# Altium project RX_test_01.PrjPcb (part 4 of 5)

## Sheet LO 2.SchDoc
size A4; SheetNumber: 9; SheetTotal: 12
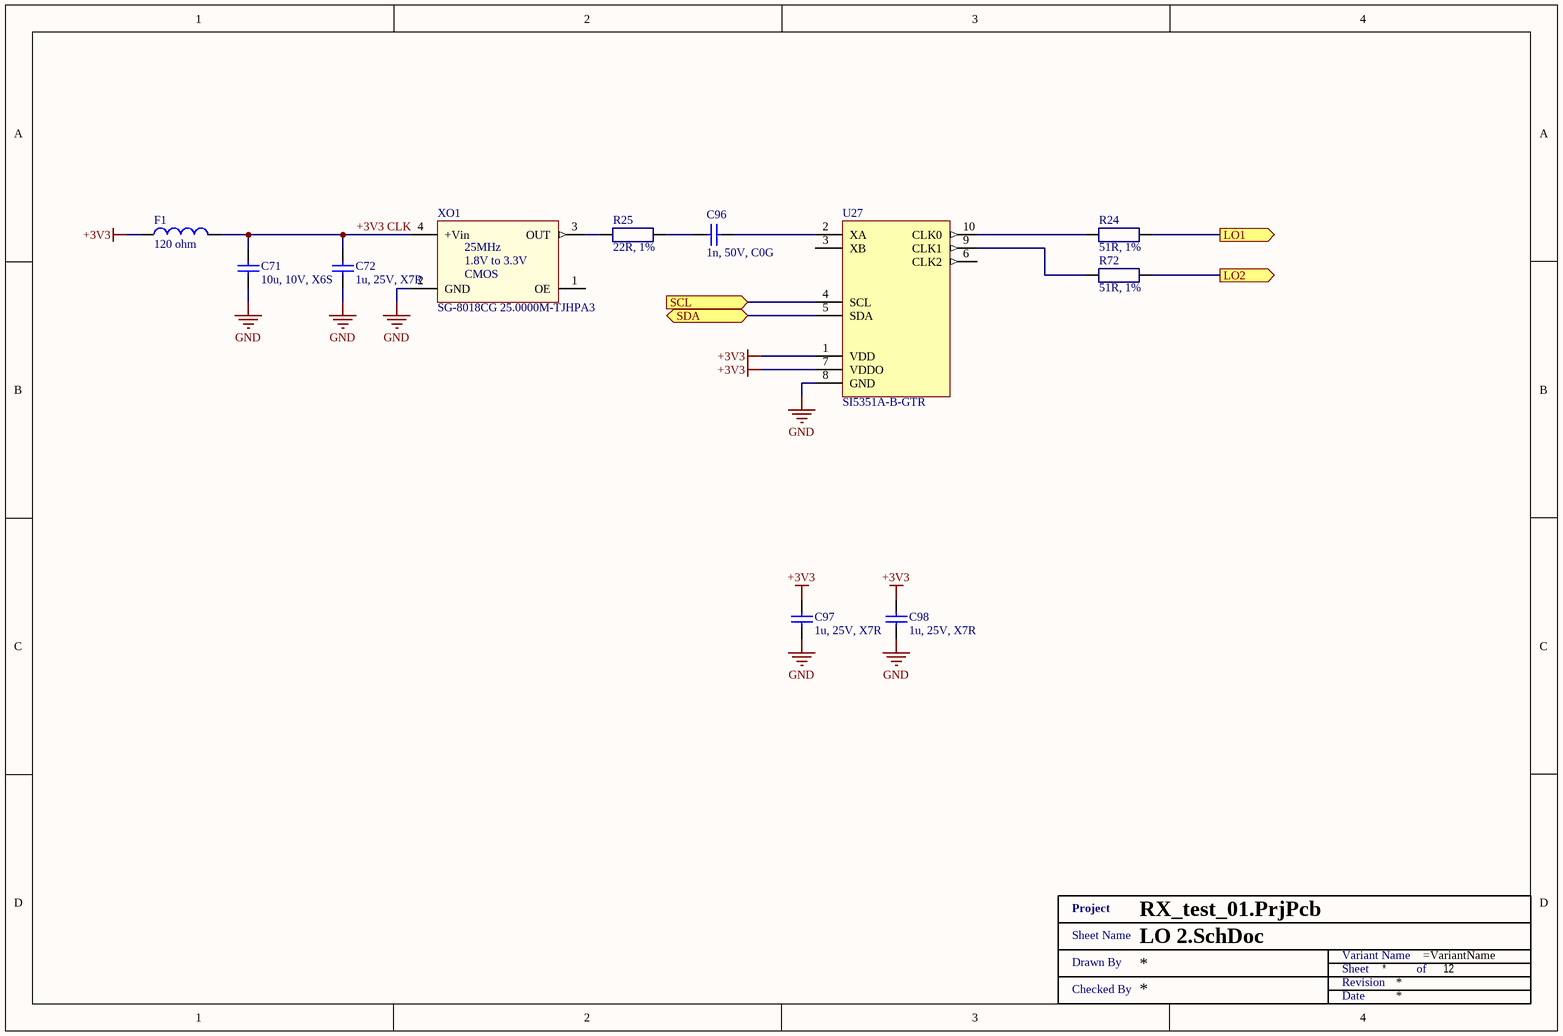
[diagram p8: LO 2.SchDoc]

### Parts
(Parts that share a designator on the sheet are numbered #1, #2 ... from top to bottom, then left to right.)
C71  10u, 10V, X6S  [SMD0603]
C72  1u, 25V, X7R  [SMD0603]
C96  1n, 50V, C0G  [SMD0603]
C97  1u, 25V, X7R  [SMD0603]
C98  1u, 25V, X7R  [SMD0603]
F1  120 ohm  [SMD0805 - R]
R24  51R, 1%  [SMD0603 - R]
R25  22R, 1%  [SMD0603 - R]
R72  51R, 1%  [SMD0603 - R]
U27  SI5351A-B-GTR  [MSOP-10]
XO1  SG-8018CG 25.0000M-TJHPA3  [XO 2.5x2.0mm]
XX?#9  Title 1  (value not drawn)  (graphical)

### Ports
LO1 (out), LO2 (out), SCL (in), SDA (bidir)

### Nets
+3V3: C97.2 C98.2 F1.2 U27.1(VDD) U27.7(VDDO)
GND: C71.1 C72.1 C97.1 C98.1 U27.8(GND) XO1.2(GND)
+3V3 CLK: C71.2 C72.2 F1.1 XO1.4(+Vin)
SCL: U27.4(SCL) ; port SCL
SDA: U27.5(SDA) ; port SDA
NetC73_1: R72.2 ; port LO2
NetC96_1: C96.1 R25.2
NetC96_2: C96.2 U27.2(XA)
NetR24_1: R24.1 U27.10(CLK0)
NetR24_2: R24.2 ; port LO1
NetR25_1: R25.1 XO1.3(OUT)
NetR72_1: R72.1 U27.9(CLK1)

Not connected (* = marked no-connect by the designer): U27 3(XB) 6(CLK2); XO1 1(OE)

### Notes on the sheet
- (in symbol SG-8018CG 25.0000M-TJHPA3) 1.8V to 3.3V; CMOS
- (in symbol Title 1) Project; Sheet Name; Variant Name; Drawn By; Sheet; of; Revision; Checked By; Date

### Library data of the parts
C71 = GRT188C81A106ME13D: Cap Ceramic 10uF 10V X6S 20% Pad SMD 0603 105C Automotive T/R; Manufacturer: Murata; Supplier 1: Mouser; Supplier Part Number 1: 81-GRT188C81A106ME3D; Manufacturer Part Number: GRT188C81A106ME13D; RoHS: No; Category: Ceramic Capacitors; Stock 1: 1862; Pricing 1: 1=0.41000, 10=0.20100, 50=0.20100, 100=0.17200, 1000=0.10900, 10000=0.09700 (USD); Mount: Surface Mount; Case/Package: 0603; Case Code (Metric): 1608; Case Code (Imperial): 0603; Min Operating Temperature: -55°C; Max Operating Temperature: 105°C; Packaging: Tape and Reel; Capacitance: 10uF; Voltage Rating: 10V; Tolerance: 20%; Length: 0.063inch; Width: 0.031inch; Thickness: 0.035inch; Ratings: AEC-Q200; ComponentLink1URL: http://search.murata.co.jp/Ceramy/image/img/A01X/G101/ENG/GRT188C81A106ME13-01.pdf?src-supplier=Digi-Key; ComponentLink1Description: http://search.murata.co.jp/Ceramy/image/img/A01X/G101/ENG/GRT188C81A106ME13-01.pdf?src-supplier=Digi-Key; Supplier 2: Farnell; Supplier Part Number 2: 3582904; Supplier 3: Digi-Key; Supplier Part Number 3: 490-12283-6-ND
C72 C97 C98 = CGA3E1X7R1E105K080AC: CAP CER 1UF 25V X7R 0603; Manufacturer: TDK Corporation; Tolerance: ±10%; Manufacturer Part Number: CGA3E1X7R1E105K080AC; RoHS: RoHS Compliant; Category: Capacitors; Stock 1: 109509; Pricing 1: 1=0.2, 10=0.135, 100=0.0686, 500=0.04696, 1000=0.04154 (USD); Packaging: Cut Tape (CT); Part Status: Active; Voltage - Rated: 25V; Temperature Coefficient: X7R; Operating Temperature: -55°C ~ 125°C; Features: -; Ratings: AEC-Q200; Applications: Automotive; Failure Rate: -; Mounting Type: Surface Mount, MLCC; Package / Case: 0603 (1608 Metric); Size / Dimension: 0.063" L x 0.032" W (1.60mm x 0.80mm); Height - Seated (Max): -; Thickness (Max): 0.035" (0.90mm); Lead Spacing: -; Lead Style: -; ComponentLink1URL: https://product.tdk.com/info/en/catalog/datasheets/mlcc_automotive_general_en.pdf; ComponentLink1Description: https://product.tdk.com/info/en/catalog/datasheets/mlcc_automotive_general_en.pdf; Capacitance: 1u; Supplier Part Number 2: 2346962
  C72: Supplier 1: Mouser; Supplier Part Number 1: 810-CGA3E1X7R1E105K; Supplier 2: Farnell; Supplier 3: Digi-Key; Supplier Part Number 3: 445-6931-1-ND
  C97 C98: Supplier 1: Digi-Key; Supplier Part Number 1: 445-6931-1-ND; Supplier 2: Mouser; Supplier Part Number 3: 810-CGA3E1X7R1E105K
C96 = MCU0603C102JCT: MULTICOMP - MCU0603C102JCT - CAP, MLCC, C0G/NP0, 1NF, 50V, 0603; Ceramic Capacitor Case: 0603 [1608 Metric]; Voltage Rating: 50; Capacitance Tolerance: ± 5%; Product Range: MCU Series; SVHC: No SVHC (07-Jul-2017); Capacitance Tolerance +: 5%; Capacitor Terminals: SMD; External Depth: 0.8; External Length / Height: 1.6; No. of Pins: 2; Reel Quantity: 4000; Temperature Coefficient: 0ppm/°C ± 30; Voltage Rating V DC: 50V<!--FANDB--><div class="features-and-benefits-container"><div class="features-and-benefits-desc-container"><span class="features-and-benefits-container-desc">SMD Multilayer Ceramic Capacitor, 0603 [1608 Metric], 1000 pF, 50 V, ± 5%, C0G / NP0; Supplier 1: Farnell; Supplier Part Number 1: 9406131; Manufacturer: MULTICOMP; Manufacturer Part Number: MCU0603C102JCT; RoHS: YES; Stock 1: 25831; Pricing 1: 10=0.0164, 100=0.0133, 500=0.0095, 1000=0.0082, 2000=0.0065 (GBP); Capacitance: 1n; Dielectric Characteristic: C0G / NP0; Packaging: Cut Tape; Operating Temperature Min: -55; Operating Temperature Max: 125; Automotive Qualification Standard: -; MSL: -; Capacitance Tolerance ±: ± 5%; External Width: 0.8; Operating Temperature Range: -55°C to +125; Tape Width: 8; Tolerance +: 5%; Tolerance -: 5%; ComponentLink1URL: http://www.farnell.com/datasheets/1723231.pdf; ComponentLink1Description: http://www.farnell.com/datasheets/1723231.pdf
F1 = 742792023: WURTH ELEKTRONIK - 742792023 - FERRITE BEAD, 0.03OHM, 3A, 0805; Impedance @ 100MHz: 120; Ferrite Case Style: 0805 [2012 Metric]; DC Current Rating: 3; DC Resistance Max: 0.03; Impedance Tolerance: ± 25%; Ferrite Mounting: SMD; Resistance: 0.03ohm<!--FANDB--><div class="features-and-benefits-container"><div class="features-and-benefits-description"><span class="features-benefits-value">The 742792023 is a SMD EMI Suppression Ferrite Bead with 0805 case and reliable Ni-Sn electrodes. It can be put directly on the printed circuit board. It offers excellent anti-EMI properties and low DC resistance. Placed very close next to the interference source even with smallest size 0402, maximal impedance at 1000; Manufacturer: WURTH ELEKTRONIK; Manufacturer Part Number: 742792023; RoHS: YES; Stock 1: 4283; Pricing 1: 1=0,123, 50=0,112, 100=0,103, 500=0,0937, 1000=0,0877, 2000=0,0846 (GBP); Product Range: -; Automotive Qualification Standard: -; Packaging: Cut Tape; ComponentLink1URL: http://www.farnell.com/datasheets/1695980.pdf; ComponentLink1Description: http://www.farnell.com/datasheets/1695980.pdf; ComponentLink2URL: http://www.farnell.com/cad/1670054.zip; ComponentLink2Description: http://www.farnell.com/cad/1670054.zip; Supplier 1: Mouser; Supplier Part Number 1: 710-742792023; Supplier 2: Farnell; Supplier Part Number 2: 1635732; Supplier 3: Digi-Key; Supplier Part Number 3: 732-1613-1-ND
R24 R72 = CRCW060351R0FKEA: RES SMD 51 OHM 1% 1/10W 0603; Manufacturer: Vishay Dale; Power (Watts): 0.1W, 1/10W; Temperature Coefficient: ±100ppm/°C; Manufacturer Part Number: CRCW060351R0FKEA; RoHS: RoHS Compliant; Category: Resistors; Stock 1: 21691; Pricing 1: 1=0.1, 10=0.042, 100=0.017, 1000=0.00764, 2500=0.00663 (USD); Packaging: Cut Tape (CT); Part Status: Active; Tolerance: ±1%; Composition: Thick Film; Features: Automotive AEC-Q200; Operating Temperature: -55°C ~ 155°C; Package / Case: 0603 (1608 Metric); Supplier Device Package: 0603; Size / Dimension: 0.063" L x 0.033" W (1.60mm x 0.85mm); Height - Seated (Max): 0.020" (0.50mm); Failure Rate: -; ComponentLink1URL: http://www.vishay.com/docs/20035/dcrcwe3.pdf; ComponentLink1Description: http://www.vishay.com/docs/20035/dcrcwe3.pdf; Resistance: 51R; Supplier 1: Mouser; Supplier Part Number 1: 71-CRCW0603-51-E3; Supplier 2: Farnell; Supplier Part Number 2: 1652889; Supplier 3: Digi-Key; Supplier Part Number 3: 541-51.0HCT-ND
R25 = RC0603FR-0722RL: YAGEO (PHYCOMP) - RC0603FR-0722RL - RES, THICK FILM, 22R, 1%, 0.1W, 0603; Voltage Rating: 50; Resistor Case Style: 0603 [1608 Metric]; Power Rating: 100; Product Range: RC Series; Temperature Coefficient: ± 100; SVHC: No SVHC (20-Jun-2016); External Depth: 0.45; External Length / Height: 1.6; External Width: 0.8; Full Power Rating Temperature: 70; No. of Pins: 2; Reel Quantity: 5000; Resistor Mounting: Surface Mount Device; Voltage Rating V DC: 50V<!--FANDB--><div class="features-and-benefits-container"><div class="features-and-benefits-desc-container"><span class="features-and-benefits-container-desc">SMD Chip Resistor, Thick Film, 22 ohm, 50 V, 0603 [1608 Metric], 100 mW, ± 1%, RC Series</span></div><div class="features-and-benefits-description"><span class="features-benefits-value">The Yageo RC_L series resistors are general purpose thick film chip resistors with lead free terminations made by thick film process. The resistance range includes E24 and E96 decade values from 1ohm to 100Mohm. These resistors are constructed on top of a high grade ceramic body.</span></div><div class="features-and-benefits-list"><ul class="features-and-benefits-list-list"><li class="features-and-benefits-list-item">EIA 0075, 0100, 0201, 0402, 0603, 0805, 1206, 1210, 1218, 2010, 2512 case sizes available</li><li class="features-and-benefits-list-item">Small chip sizes save PCB space</li><li class="features-and-benefits-list-item">Rated voltage range of 10V to 200V</li><li class="features-and-benefits-list-item">Maximum power rating of 2W</li><li class="features-and-benefits-list-item">Available in ±0.1%, ±0.5%, ±1% and ±5% tolerance</li><li class="features-and-benefits-list-item">High component and equipment reliability</li><li class="features-and-benefits-list-item">Forbidden materials are not used in products/production</li><li class="features-and-benefits-list-item">-55°C to 155°C temperature range for RC0402 to RC2512 and -55°C to 125°C for RC0075 to RC0201; Manufacturer: YAGEO (PHYCOMP); Manufacturer Part Number: RC0603FR-0722RL; RoHS: YES; Stock 1: 33025; Pricing 1: 10=0.0102, 100=0.0068, 500=0.0051, 1000=0.0041, 2500=0.0034 (GBP); Resistance: 22R; Resistance Tolerance: ± 1%; Packaging: Cut Tape; Resistor Element Material: Thick Film; Automotive Qualification Standard: -; MSL: MSL 1 - Unlimited; Operating Temperature Max: 155; Operating Temperature Min: -55; Operating Temperature Range: -55°C to +155; Temperature Coeff. +: 100; Temperature Coeff. -: 100; Tolerance +: 1%; Tolerance -: 1%; ComponentLink1URL: http://www.farnell.com/datasheets/2167052.pdf; ComponentLink1Description: http://www.farnell.com/datasheets/2167052.pdf; ComponentLink2URL: http://www.farnell.com/cad/1555248.zip; ComponentLink2Description: http://www.farnell.com/cad/1555248.zip; Supplier 1: Mouser; Supplier Part Number 1: 603-RC0603FR-0722RL; Supplier 2: Farnell; Supplier Part Number 2: 9238280; Supplier 3: Digi-Key; Supplier Part Number 3: 311-22.0HRCT-ND
U27 = SI5351A-B-GTR: IC CLK GENERATOR 200MHZ 10MSOP; Manufacturer: Silicon Labs; Number of Outputs: 3; Max Duty Cycle: 55%; Operating Supply Current: 22mA; Number of Circuits: 2; Input: Crystal; PLL: Yes; Operating Supply Voltage: 3.3V; Supplier 1: Mouser; Supplier Part Number 1: 634-SI5351A-B-GTR; Manufacturer Part Number: SI5351A-B-GTR; RoHS: Yes; Category: Clock Generators, PLLs, Frequency Synthesizers; Mount: Surface Mount; Case/Package: MSOP; Number of Pins: 10; Min Operating Temperature: -40°C; Max Operating Temperature: 85°C; Packaging: Tape and Reel; Package Quantity: 2500; Max Frequency: 200MHz; Series: MultiSynth™; RoHS Compliant: Yes; ComponentLink1URL: http://www.mouser.com/ds/2/368/Si5351-B-346869.pdf?src-supplier=Mouser; ComponentLink1Description: http://www.mouser.com/ds/2/368/Si5351-B-346869.pdf?src-supplier=Mouser; ComponentLink2URL: https://www.silabs.com/Support%20Documents/TechnicalDocs/Si5350-51-short.pdf?src-supplier=Digi-Key; ComponentLink2Description: https://www.silabs.com/Support%20Documents/TechnicalDocs/Si5350-51-short.pdf?src-supplier=Digi-Key; ComponentLink3URL: https://www.silabs.com/documents/public/data-sheets/Si5351-B.pdf?src-supplier=Digi-Key; ComponentLink3Description: https://www.silabs.com/documents/public/data-sheets/Si5351-B.pdf?src-supplier=Digi-Key; ComponentLink4URL: https://www.silabs.com/Support%20Documents/TechnicalDocs/Si5351-B.pdf?src-supplier=Avnet; ComponentLink4Description: https://www.silabs.com/Support%20Documents/TechnicalDocs/Si5351-B.pdf?src-supplier=Avnet; ComponentLink5URL: https://www.silabs.com/Support%20Documents/TechnicalDocs/Si5351-B.pdf?src-supplier=Avnet+Asia; ComponentLink5Description: https://www.silabs.com/Support%20Documents/TechnicalDocs/Si5351-B.pdf?src-supplier=Avnet+Asia; Supplier 2: Farnell; Supplier Part Number 2: 3105964; Supplier 3: Digi-Key; Supplier Part Number 3: 336-3908-1-ND
XO1 = SG-8018CG 25.0000M-TJHPA3: Oscillator XO 25MHz ±50ppm 15pF CMOS 55% 1.8V/2.5V/3.3V 4-Pin SMD T/R; Manufacturer: Epson; Supplier 1: Mouser; Supplier Part Number 1: 732-CG25M-TJHPA3; Manufacturer Part Number: SG-8018CG 25.0000M-TJHPA3; Stock 1: 221; Pricing 1: 1=1,11000, 10=1,03000, 100=0,88700, 250=0,88700, 500=0,78900, 1000=0,72700 (USD); ComponentLink1URL: http://datasheet.octopart.com/SG-8018CG-25.0000M-TJHPA3-Epson-datasheet-137868109.pdf?src-supplier=Future+Electronics; ComponentLink1Description: http://datasheet.octopart.com/SG-8018CG-25.0000M-TJHPA3-Epson-datasheet-137868109.pdf?src-supplier=Future+Electronics; Supplier 2: Arrow; Supplier Part Number 2: SG-8018CG 25.0000M-TJHPA3; Supplier 3: Future Electronics; Supplier Part Number 3: SG-8018CG 25.0000M-TJHPA3-REEL; Freq: 25MHz

## Sheet Control panel.SchDoc
size A4; SheetNumber: 10; SheetTotal: 12
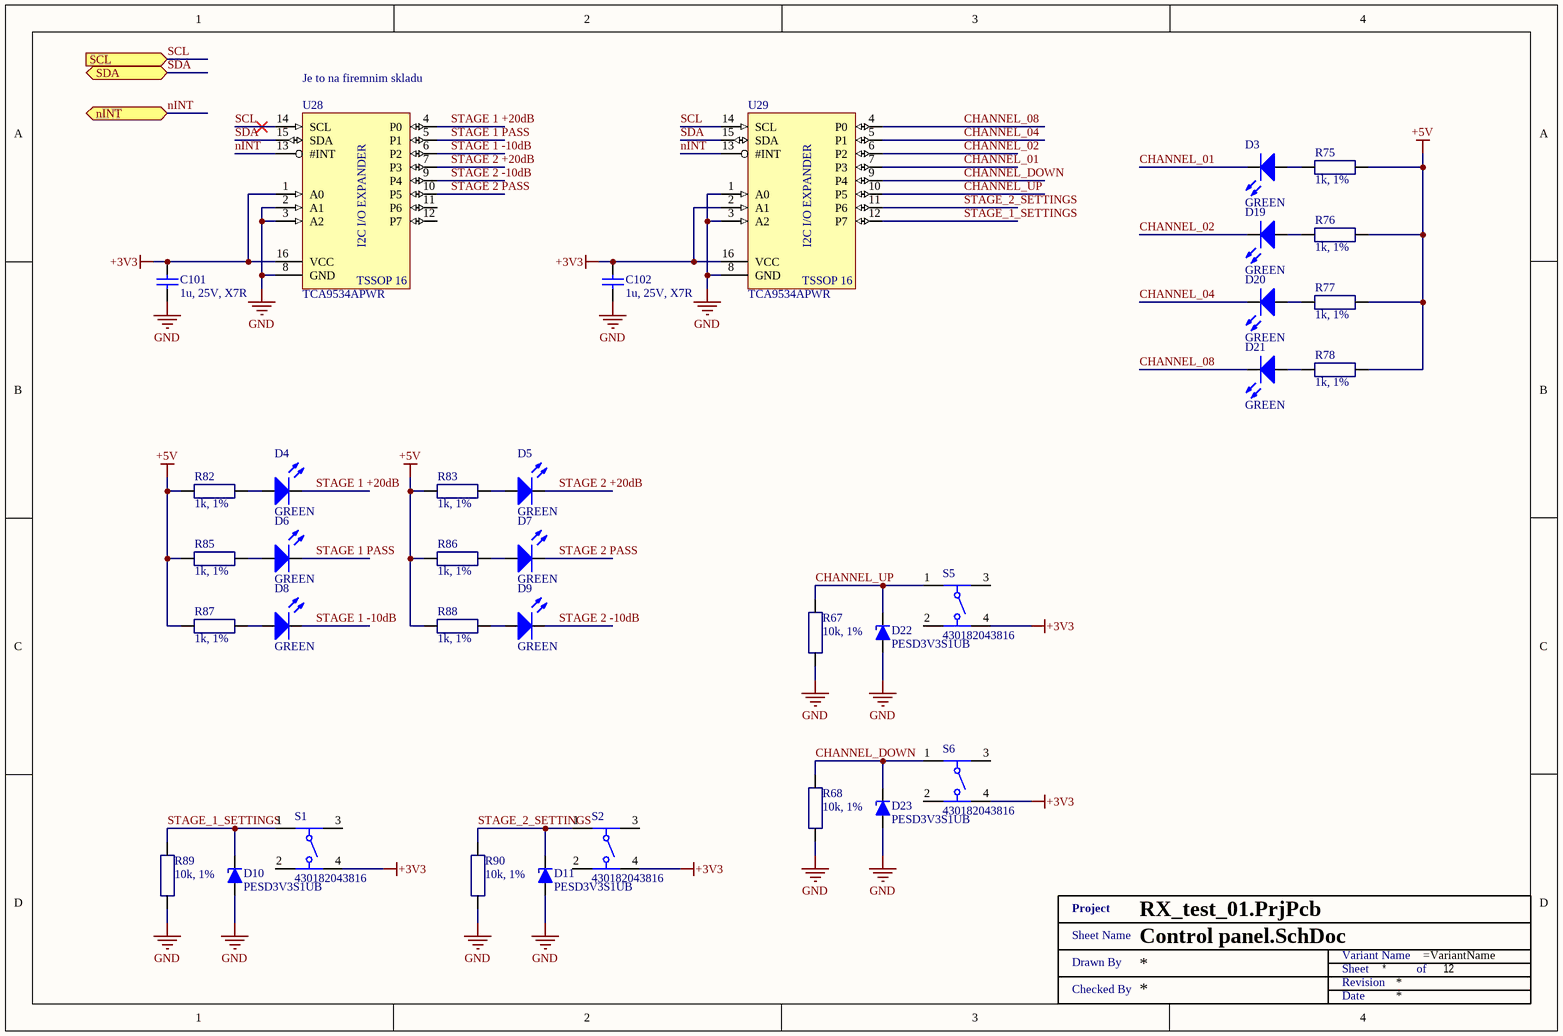
[diagram p9: Control panel.SchDoc]

### Parts
(Parts that share a designator on the sheet are numbered #1, #2 ... from top to bottom, then left to right.)
C101  1u, 25V, X7R  [SMD0603]
C102  1u, 25V, X7R  [SMD0603]
D3  GREEN  [MCL-S270]
D4  GREEN  [MCL-S270]
D5  GREEN  [MCL-S270]
D6  GREEN  [MCL-S270]
D7  GREEN  [MCL-S270]
D8  GREEN  [MCL-S270]
D9  GREEN  [MCL-S270]
D10  PESD3V3S1UB  [SOD523]
D11  PESD3V3S1UB  [SOD523]
D19  GREEN  [MCL-S270]
D20  GREEN  [MCL-S270]
D21  GREEN  [MCL-S270]
D22  PESD3V3S1UB  [SOD523]
D23  PESD3V3S1UB  [SOD523]
R67  10k, 1%  [SMD0603 - R]
R68  10k, 1%  [SMD0603 - R]
R75  1k, 1%  [SMD0603 - R]
R76  1k, 1%  [SMD0603 - R]
R77  1k, 1%  [SMD0603 - R]
R78  1k, 1%  [SMD0603 - R]
R82  1k, 1%  [SMD0603 - R]
R83  1k, 1%  [SMD0603 - R]
R85  1k, 1%  [SMD0603 - R]
R86  1k, 1%  [SMD0603 - R]
R87  1k, 1%  [SMD0603 - R]
R88  1k, 1%  [SMD0603 - R]
R89  10k, 1%  [SMD0603 - R]
R90  10k, 1%  [SMD0603 - R]
S1  430182043816  [430182043816]
S2  430182043816  [430182043816]
S5  430182043816  [430182043816]
S6  430182043816  [430182043816]
U28  TCA9534APWR  [TSSOP16N]
U29  TCA9534APWR  [TSSOP16N]
XX?#10  Title 1  (value not drawn)  (graphical)

### Ports
nINT (bidir), SCL (in), SDA (bidir)

### Nets
+3V3: C101.2 C102.2 S1.4 S2.4 S5.4 S6.4 U28.1(A0) U28.16(VCC) U29.2(A1) U29.16(VCC)
+5V: R75.2 R76.2 R77.2 R78.2 R82.1 R83.1 R85.1 R86.1 R87.1 R88.1
GND: C101.1 C102.1 D10.2(K) D11.2(K) D22.2(K) D23.2(K) R67.2 R68.2 R89.2 R90.2 U28.2(A1) U28.3(A2) U28.8(GND) U29.1(A0) U29.3(A2) U29.8(GND)
CHANNEL_01: D3.2(K) U29.7(P3)
CHANNEL_02: D19.2(K) U29.6(P2)
CHANNEL_04: D20.2(K) U29.5(P1)
CHANNEL_08: D21.2(K) U29.4(P0)
CHANNEL_DOWN: D23.1(A) R68.1 S6.1 U29.9(P4)
CHANNEL_UP: D22.1(A) R67.1 S5.1 U29.10(P5)
nINT: U28.13(#INT) U29.13(#INT) ; port nINT
SCL: U28.14(SCL) U29.14(SCL) ; port SCL
SDA: U28.15(SDA) U29.15(SDA) ; port SDA
STAGE 1 +20dB: D4.2(K) U28.4(P0)
STAGE 1 -10dB: D8.2(K) U28.6(P2)
STAGE 1 PASS: D6.2(K) U28.5(P1)
STAGE 2 +20dB: D5.2(K) U28.7(P3)
STAGE 2 -10dB: D9.2(K) U28.9(P4)
STAGE 2 PASS: D7.2(K) U28.10(P5)
STAGE_1_SETTINGS: D10.1(A) R89.1 S1.1 U29.12(P7)
STAGE_2_SETTINGS: D11.1(A) R90.1 S2.1 U29.11(P6)
NetD3_1: D3.1(A) R75.1
NetD4_1: D4.1(A) R82.2
NetD5_1: D5.1(A) R83.2
NetD6_1: D6.1(A) R85.2
NetD7_1: D7.1(A) R86.2
NetD8_1: D8.1(A) R87.2
NetD9_1: D9.1(A) R88.2
NetD19_1: D19.1(A) R76.1
NetD20_1: D20.1(A) R77.1
NetD21_1: D21.1(A) R78.1

Not connected (* = marked no-connect by the designer): S1 2 3; S2 2 3; S5 2 3; S6 2 3; U28 11(P6) 12(P7)

### Notes on the sheet
- (near U28) Je to na firemnim skladu
- (in symbol TCA9534APWR) I2C I/O EXPANDER; TSSOP 16
- (in symbol Title 1) Project; Sheet Name; Variant Name; Drawn By; Sheet; of; Revision; Checked By; Date

### Library data of the parts
C101 C102 = CGA3E1X7R1E105K080AC: as C72 on sheet LO 2; Manufacturer Part Number: CGA3E1X7R1E105K080AC; RoHS: RoHS Compliant; Category: Capacitors; Stock 1: 109509; Pricing 1: 1=0.2, 10=0.135, 100=0.0686, 500=0.04696, 1000=0.04154 (USD); Packaging: Cut Tape (CT); Part Status: Active; Voltage - Rated: 25V; Temperature Coefficient: X7R; Operating Temperature: -55°C ~ 125°C; Features: -; Ratings: AEC-Q200; Applications: Automotive; Failure Rate: -; Mounting Type: Surface Mount, MLCC; Package / Case: 0603 (1608 Metric); Size / Dimension: 0.063" L x 0.032" W (1.60mm x 0.80mm); Height - Seated (Max): -; Thickness (Max): 0.035" (0.90mm); Lead Spacing: -; Lead Style: -; ComponentLink1URL: https://product.tdk.com/info/en/catalog/datasheets/mlcc_automotive_general_en.pdf; ComponentLink1Description: https://product.tdk.com/info/en/catalog/datasheets/mlcc_automotive_general_en.pdf; Capacitance: 1u; Supplier 1: Mouser; Supplier Part Number 1: 810-CGA3E1X7R1E105K; Supplier 2: Farnell; Supplier Part Number 2: 2346962; Supplier 3: Digi-Key; Supplier Part Number 3: 445-6931-1-ND
D3-D9 D19-D21 = MCL-S270GC: MULTICOMP - MCL-S270GC - LED, 0805, GREEN, 10MCD, 570NM; LED Mounting: SMD; Bulb Size: 1.25mm x 1.4; Forward Current If: 20; Forward Voltage: 2.1; Wavelength Typ: 570; Luminous Intensity: 10; Viewing Angle: 140°; Lens Shape: Rectangular; SVHC: No SVHC (17-Dec-2015); Forward Voltage VF Max: 2.6; LED / Lamp Size: 1.4mm x 1.25; LED Type: Standard; Luminous Intensity Max: 16; Luminous Intensity Min: 4.5; No. of Pins: 2; Peak Forward Current: 100; Peak Wavelength: 568; Reverse Protection Voltage: 5; Voltage Vf Min: 1.7; Voltage Vf Typ: 2.1V<!--FANDB--><div class="features-and-benefits-container"><div class="features-and-benefits-description"><span class="features-benefits-value">The MCL-S270GC is a green SMD LED made of GaP dice. This LED offers water clear rectangular lens and 260°C for 5 seconds lead soldering temperature range 1.6mm from body.</span></div><div class="features-and-benefits-list"><ul class="features-and-benefits-list-list"><li class="features-and-benefits-list-item">-40 to 85; Manufacturer: MULTICOMP; Manufacturer Part Number: MCL-S270GC; RoHS: YES; Stock 1: 80989; Pricing 1: 5=0,145, 25=0,136, 100=0,126, 250=0,0813, 500=0,0645, 2000=0,0559, 5000=0,0496, 20000=0,0434 (GBP); LED Colour: Green; Packaging: Cut Tape; Product Range: -; Automotive Qualification Standard: -; MSL: MSL 3 - 168 hours; Current Rating: 20; Dominant Wavelength: 570; Dominant Wavelength Typ: 570; Forward Current If Max: 20; Luminous Intensity Typ: 10; Operating Temperature Max: 85; Operating Temperature Min: -40; Operating Temperature Range: -40°C to +85; Storage Temperature Max: +100; Storage Temperature Min: -40; ComponentLink1URL: http://www.farnell.com/cad/53028.pdf; ComponentLink1Description: http://www.farnell.com/cad/53028.pdf; ComponentLink2URL: http://www.farnell.com/datasheets/1671537.pdf; ComponentLink2Description: http://www.farnell.com/datasheets/1671537.pdf; Supplier 1: Farnell; Supplier Part Number 1: 1581242; Supplier 2: Newark; Supplier Part Number 2: 14N9356
D10 D11 D22 D23 = PESD3V3S1UB,115: TVS DIODE 3.3V 20V SOD523; Manufacturer: Nexperia USA Inc.; Type: Zener; Voltage - Reverse Standoff (Typ): 3.3V (Max); Voltage - Breakdown (Min): 5.2V; Current - Peak Pulse (10/1000µs): 18A (8/20µs); Power - Peak Pulse: 330W; Power Line Protection: No; Capacitance @ Frequency: 207pF @ 1MHz; Manufacturer Part Number: PESD3V3S1UB,115; RoHS: RoHS Compliant; Category: Circuit Protection; Stock 1: 0; Pricing 1: 1=0.49, 10=0.368, 100=0.2082, 500=0.1379, 1000=0.10573 (USD); Packaging: Cut Tape (CT); Part Status: Active; Voltage - Clamping (Max) @ Ipp: 20V; Applications: General Purpose; Operating Temperature: -65°C ~ 150°C (TA); Mounting Type: Surface Mount; Package / Case: SC-79, SOD-523; Supplier Device Package: SOD-523; Base Part Number: PESD*S1U; ComponentLink1URL: https://assets.nexperia.com/documents/data-sheet/PESDXS1UB_SERIES.pdf; ComponentLink1Description: https://assets.nexperia.com/documents/data-sheet/PESDXS1UB_SERIES.pdf; Supplier 1: Mouser; Supplier Part Number 1: 771-PESD3V3S1UB-T/R; Supplier 2: Farnell; Supplier Part Number 2: 8737568; Supplier 3: Digi-Key; Supplier Part Number 3: 1727-3829-1-ND; Supplier 4: TME; Supplier Part Number 4: PESD3V3S1UB.115
R67 R68 R89 R90 = RC0603FR-0710KL: YAGEO (PHYCOMP) - RC0603FR-0710KL - RES, THICK FILM, 10K, 1%, 0.1W, 0603; Voltage Rating: 50; Resistor Case Style: 0603 [1608 Metric]; Power Rating: 100; Product Range: RC Series; Temperature Coefficient: ± 100; SVHC: No SVHC (20-Jun-2016); Manufacturer: YAGEO (PHYCOMP); Manufacturer Part Number: RC0603FR-0710KL; RoHS: YES; Stock 1: 9995; Pricing 1: 5000=0.0025, 25000=0.0014, 50000=0.0013 (GBP); Resistance: 10k; Resistance Tolerance: ± 1%; Packaging: Tape & Reel; Resistor Element Material: Thick Film; Automotive Qualification Standard: -; MSL: MSL 1 - Unlimited<!--FANDB--><div class="features-and-benefits-container"><div class="features-and-benefits-desc-container"><span class="features-and-benefits-container-desc">SMD Chip Resistor, Thick Film, 10 kohm, 50 V, 0603 [1608 Metric], 100 mW, ± 1; ComponentLink1URL: http://past.yageo.com/pdf/PYu-R_Packing_6.pdf; ComponentLink1Description: http://past.yageo.com/pdf/PYu-R_Packing_6.pdf; ComponentLink2URL: http://www.farnell.com/datasheets/2167052.pdf; ComponentLink2Description: http://www.farnell.com/datasheets/2167052.pdf; Supplier 1: Mouser; Supplier Part Number 1: 603-RC0603FR-0710KL; Supplier 2: Farnell; Supplier Part Number 2: 2421850; Supplier 3: Digi-Key; Supplier Part Number 3: 311-10.0KHRCT-ND
R75-R78 R82 R83 R85-R88 = MCWR06X1001FTL: MULTICOMP - MCWR06X1001FTL - RES, THICK FILM, 1K, 1%, 0.1W, 0603; Voltage Rating: 50; Resistor Case Style: 0603 [1608 Metric]; Power Rating: 100; Product Range: MCWR Series; Temperature Coefficient: ± 100; SVHC: No SVHC (07-Jul-2017)<!--FANDB--><div class="features-and-benefits-container"><div class="features-and-benefits-desc-container"><span class="features-and-benefits-container-desc">SMD Chip Resistor, Thick Film, 1 kohm, 50 V, 0603 [1608 Metric], 100 mW, ± 1; Manufacturer: MULTICOMP; Manufacturer Part Number: MCWR06X1001FTL; RoHS: Y-EX; Stock 1: 134740; Pricing 1: 10=0.0037, 100=0.0022, 500=0.0016, 1000=0.0012, 2500=0.001 (GBP); Resistance: 1k; Resistance Tolerance: ± 1%; Packaging: Cut Tape; Resistor Element Material: Thick Film; Automotive Qualification Standard: -; ComponentLink1URL: http://www.farnell.com/datasheets/1849611.pdf; ComponentLink1Description: http://www.farnell.com/datasheets/1849611.pdf; Supplier 1: Farnell; Supplier Part Number 1: 2447272; Supplier 2: Newark; Supplier Part Number 2: 94X1378
S1 S2 S5 S6 = 430182043816: WS-TASV SMT Tact Switch, 6x6x4.3mm, 160gf; Manufacturer: Wurth Elektronik; Rated Voltage: 12VDC; Rated Current: 50mA; Washable: No; ComponentLink1Description: Manufacturer; ComponentLink1URL: http://www.we-online.de; ComponentLink2Description: Datasheet; ComponentLink2URL: https://www.we-online.com/catalog/datasheet/430182043816.pdf; Operating Temperature: -40 to +85degC; Manufacturer Part Number: 430182043816; Published Date: November 2020; Contact Material: Stainless Steel; Size: 6x6x4.3mm; Mounting Technology: SMT; Contact Plating: Silver; Operation Force: 160gf; Packaging: Tape and Reel; Terminal Material: Copper Alloy; Terminal Plating: Silver; Supplier 1: Mouser; Supplier Part Number 1: 710-430182043816; Supplier 2: Farnell; Supplier Part Number 2: 2065105; Supplier 3: RSComponents; Supplier Part Number 3: 7856260
U28 U29 = TCA9534APWR: IC I/O EXPANDER I2C 8B 16TSSOP; Manufacturer: Texas Instruments; Number of I/Os: 8; Frequency: 400kHz; Supplier 1: Mouser; Supplier Part Number 1: 595-TCA9534APWR; Manufacturer Part Number: TCA9534APWR; Stock 1: 3614; Pricing 1: 1 = 1.25000, 10 = 1.07000, 50 = 1.07000, 100 = 0.81500, 500 = 0.72100, 1000 = 0.56900, 2000 = 0.50500, 10000 = 0.48600, 24000 = 0.47000, 50000 = 0.45500 (USD); RoHS: Yes; Mount: Surface Mount; Case/Package: TSSOP; Number of Pins: 16; Contact Plating: Gold; Min Operating Temperature: -40°C; Max Operating Temperature: 85°C; Packaging: Tape and Reel; Interface: I2C; Number of Outputs: 8; Lead Free: Lead Free; ComponentLink1URL: http://www.ti.com/general/docs/lit/getliterature.tsp?genericPartNumber=TCA9534A&&fileType=pdf&src-supplier=Avnet; ComponentLink1Description: http://www.ti.com/general/docs/lit/getliterature.tsp?genericPartNumber=TCA9534A&&fileType=pdf&src-supplier=Avnet; ComponentLink2URL: http://www.ti.com/lit/ds/symlink/tca9534a.pdf?src-supplier=Digi-Key; ComponentLink2Description: http://www.ti.com/lit/ds/symlink/tca9534a.pdf?src-supplier=Digi-Key; ComponentLink3URL: http://www.ti.com/general/docs/lit/getliterature.tsp?genericPartNumber=TCA9534A&&fileType=pdf&src-supplier=Avnet+Asia; ComponentLink3Description: http://www.ti.com/general/docs/lit/getliterature.tsp?genericPartNumber=TCA9534A&&fileType=pdf&src-supplier=Avnet+Asia; ComponentLink4URL: http://www.ti.com/lit/pdf/sszc003?src-supplier=Digi-Key; ComponentLink4Description: http://www.ti.com/lit/pdf/sszc003?src-supplier=Digi-Key; Supplier 2: Digi-Key; Supplier Part Number 2: 296-40573-1-ND; Supplier 3: Arrow; Supplier Part Number 3: TCA9534APWR

## Sheet Power.SchDoc
size A4; SheetNumber: 13; SheetTotal: 13
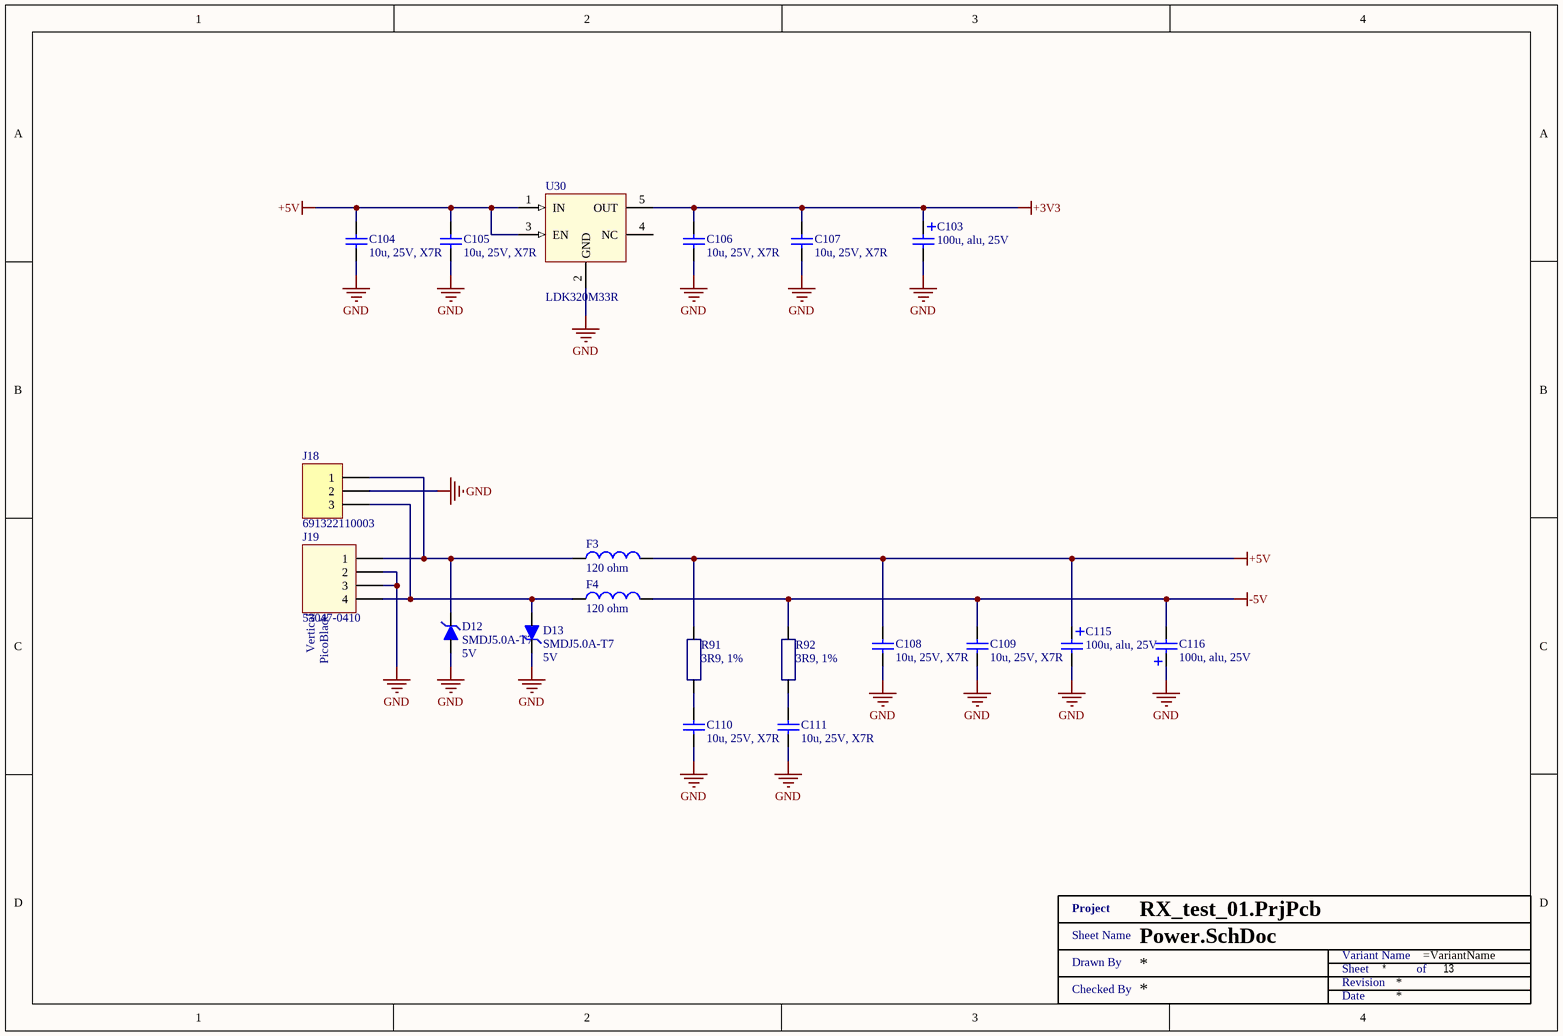
[diagram p10: Power.SchDoc]

### Parts
(Parts that share a designator on the sheet are numbered #1, #2 ... from top to bottom, then left to right.)
C103  100u, alu, 25V  [WCAP-ATLI_6.3x11x2.5]
C104  10u, 25V, X7R  [SMD1206]
C105  10u, 25V, X7R  [SMD1206]
C106  10u, 25V, X7R  [SMD1206]
C107  10u, 25V, X7R  [SMD1206]
C108  10u, 25V, X7R  [SMD1206]
C109  10u, 25V, X7R  [SMD1206]
C110  10u, 25V, X7R  [SMD1206]
C111  10u, 25V, X7R  [SMD1206]
C115  100u, alu, 25V  [WCAP-ATLI_6.3x11x2.5]
C116  100u, alu, 25V  [WCAP-ATLI_6.3x11x2.5]
D12  SMDJ5.0A-T7  Reverse Standoff Voltage: 5V  [DO-214AB]
D13  SMDJ5.0A-T7  Reverse Standoff Voltage: 5V  [DO-214AB]
F3  120 ohm  [SMD0805 - R]
F4  120 ohm  [SMD0805 - R]
J18  691322110003  [691322110003]
J19  53047-0410  [530470410]
R91  3R9, 1%  [SMD0603 - R]
R92  3R9, 1%  [SMD0603 - R]
U30  LDK320M33R  [SOT23-5]
XX?#11  Title 1  (value not drawn)  (graphical)

### Nets
+3V3: C103.1 C106.2 C107.2 U30.5(OUT)
+5V: C104.2 C105.2 C108.2 C115.1 F3.2 R91.2 U30.1(IN) U30.3(EN)
-5V: C109.2 C116.2 F4.2 R92.2
GND: C103.2 C104.1 C105.1 C106.1 C107.1 C108.1 C109.1 C110.1 C111.1 C115.2 C116.1 D12.2 D13.1 J18.2 J19.2 J19.3 U30.2(GND)
NetC110_2: C110.2 R91.1
NetC111_2: C111.2 R92.1
NetD12_1: D12.1 F3.1 J18.1 J19.1
NetD13_2: D13.2 F4.1 J18.3 J19.4

Not connected (* = marked no-connect by the designer): U30 4(NC)

### Notes on the sheet
- (in symbol 53047-0410) Vertical; PicoBlade
- (in symbol Title 1) Project; Sheet Name; Variant Name; Drawn By; Sheet; of; Revision; Checked By; Date

### Library data of the parts
C103 C115 C116 = 860010473007: CAP 100 UF 20% 25 V; Manufacturer: Wurth Electronics; Material: Aluminium; Capacitance: 100uF; Polarity: Polar; Ripple Current: 209mA; Life (Hours): 2000Hour; Supplier 1: Mouser; Supplier Part Number 1: 710-860010473007; Manufacturer Part Number: 860010473007; RoHS: Yes; Category: Aluminum Electrolytic Capacitors; Stock 1: 1494; Pricing 1: 1=0.14000, 10=0.13400, 25=0.13400, 50=0.11200, 100=0.09800, 250=0.08700 (USD); Mount: Through Hole; Case/Package: Radial; Min Operating Temperature: -40°C; Max Operating Temperature: 85°C; Tolerance: 20%; Voltage Rating (DC): 25V; Package Quantity: 1500; Packaging: Tape and Reel; Voltage Rating: 25V; Diameter: 6.3mm; Height: 11mm; Lead Pitch: 0.098inch; Height - Seated (Max): 0.492inch; REACH SVHC: Unknown; ComponentLink1URL: https://datasheet.ciiva.com/48693/001280151-da-01-en-wcap-atg8-alu-elec-caps-860010473007-48693591.pdf?src-supplier=Conrad; ComponentLink1Description: https://datasheet.ciiva.com/48693/001280151-da-01-en-wcap-atg8-alu-elec-caps-860010473007-48693591.pdf?src-supplier=Conrad; Supplier 2: Farnell; Supplier Part Number 2: 2465675; Supplier 3: Digi-Key; Supplier Part Number 3: 732-8630-1-ND
C104-C111 = GRM31CR71E106KA12L: MURATA - GRM31CR71E106KA12L - CAP, MLCC, X7R, 10UF, 25V, 1206; Manufacturer: MURATA; Manufacturer Part Number: GRM31CR71E106KA12L; RoHS: YES; Stock 1: 8848; Pricing 1: 5=0.278, 50=0.185, 250=0.139, 500=0.134, 1000=0.128 (GBP); ComponentLink1URL: http://www.farnell.com/datasheets/2048746.pdf; ComponentLink1Description: http://www.farnell.com/datasheets/2048746.pdf; Capacitance: 10u; Dielectric: X7R; Supplier 1: Mouser; Supplier Part Number 1: 81-GRM31CR71E106KA12; Supplier 2: Farnell; Supplier Part Number 2: 1828837; Supplier 3: Digi-Key; Supplier Part Number 3: 490-6518-1-ND
D12 D13 = SMDJ5.0A-T7: TVS DIODE 5V 9.2V DO214AB; Manufacturer: Littelfuse; Peak Pulse Current: 326.1A; Number of Unidirectional Channels: 1; Min Breakdown Voltage: 6.4V; Peak Pulse Power: 3kW; Power Line Protection: No; Supplier 1: Mouser; Supplier Part Number 1: 576-SMDJ5.0A-T7; Manufacturer Part Number: SMDJ5.0A-T7; RoHS: Yes; Category: TVS Diodes; Stock 1: 117; Pricing 1: 1=0.84000, 10=0.71500, 50=0.71500, 100=0.56800, 500=0.46100, 1000=0.46100, 10000=0.46100 (USD); Mount: Surface Mount; Number of Pins: 2; Min Operating Temperature: -55°C; Max Operating Temperature: 150°C; Packaging: Tape and Reel; Package Quantity: 500; Resistor Type: Zener; Clamping Voltage: 9.2V; Lead Free: Contains Lead; ComponentLink1URL: http://components.arrow.com/part/dataview/51478447S87545N3675?src-supplier=Arrow+Electronics; ComponentLink1Description: http://components.arrow.com/part/dataview/51478447S87545N3675?src-supplier=Arrow+Electronics; ComponentLink2URL: http://www.mouser.com/ds/2/240/Littelfuse_TVS_Diode_SMCJ_HRA_Datasheet.pdf-693424.pdf?src-supplier=Mouser; ComponentLink2Description: http://www.mouser.com/ds/2/240/Littelfuse_TVS_Diode_SMCJ_HRA_Datasheet.pdf-693424.pdf?src-supplier=Mouser; Supplier 2: Digi-Key; Supplier Part Number 2: 18-SMDJ5.0A-T7CT-ND; Supplier 3: Arrow Electronics; Supplier Part Number 3: SMDJ5.0A-T7
F3 F4 = 742792023: WURTH ELEKTRONIK - 742792023 - FERRITE BEAD, 0.03OHM, 3A, 0805; Impedance @ 100MHz: 120; Ferrite Case Style: 0805 [2012 Metric]; DC Current Rating: 3; DC Resistance Max: 0.03; Impedance Tolerance: ± 25%; Ferrite Mounting: SMD; Resistance: 0.03ohm<!--FANDB--><div class="features-and-benefits-container"><div class="features-and-benefits-description"><span class="features-benefits-value">The 742792023 is a SMD EMI Suppression Ferrite Bead with 0805 case and reliable Ni-Sn electrodes. It can be put directly on the printed circuit board. It offers excellent anti-EMI properties and low DC resistance. Placed very close next to the interference source even with smallest size 0402, maximal impedance at 1000; Manufacturer: WURTH ELEKTRONIK; Manufacturer Part Number: 742792023; RoHS: YES; Stock 1: 4283; Pricing 1: 1=0,123, 50=0,112, 100=0,103, 500=0,0937, 1000=0,0877, 2000=0,0846 (GBP); Product Range: -; Automotive Qualification Standard: -; Packaging: Cut Tape; ComponentLink1URL: http://www.farnell.com/datasheets/1695980.pdf; ComponentLink1Description: http://www.farnell.com/datasheets/1695980.pdf; ComponentLink2URL: http://www.farnell.com/cad/1670054.zip; ComponentLink2Description: http://www.farnell.com/cad/1670054.zip; Supplier 1: Mouser; Supplier Part Number 1: 710-742792023; Supplier 2: Farnell; Supplier Part Number 2: 1635732; Supplier 3: Digi-Key; Supplier Part Number 3: 732-1613-1-ND
J18 = 691322110003: WR-TBL Serie 3221 - 3.50 mm Horizontal PCB Header, 03p; Pitch: 3.5 mm; Published Date: Jan 2017; Publisher: Wurth Elektronik; ComponentLink1Description: Manufacturer; ComponentLink1URL: http://www.we-online.de; ComponentLink2Description: Datasheet; ComponentLink2URL: http://katalog.we-online.de/em/datasheet/6913221100xx.pdf; Part Number: 691322110003; Pin Number: 03p; Supplier 1: Digi-Key; Supplier Part Number 1: 732-2770-ND; Supplier 2: Farnell; Supplier Part Number 2: 1841316
J19 = 53047-0410: 1.25mm Pitch, PicoBlade PCB Header, Single Row, Vertical, Through Hole, Tin Plating, Friction Lock, 4 Circuits, Tray, 2.30mm PC Tail Length; Manufacturer: Molex; Manufacturer Part Number: 0530470410; Number of Positions: 4; Max Voltage Rating (AC): 125V; Contact Resistance: 20mR; Connector Type: Blade Pin; RoHS: Yes; Category: Headers and Wire Housings; Stock 4: 7971; Pricing 4: 1=0,27000, 10=0,23400, 100=0,18000, 500=0,15400, 1000=0,13000, 5000=0,11200, 10000=0,10400 (USD); Mount: Through Hole; Housing Material: Nylon; Contact Plating: Tin; Contact Material: Bronze; Color: Natural; Housing Color: White; Min Operating Temperature: -40°C; Max Operating Temperature: 85°C; Termination: Solder; Number of Contacts: 4; Packaging: Tray; Number of Rows: 1; Orientation: Straight; Length: 6.75mm; Pitch: 1.25mm; Contact Mating Length: 0.089inch; Depth: 3.2mm; ComponentLink1URL: https://datasheet.ciiva.com/3934/87920530470410-pcb-headers-3934064.pdf?src-supplier=Arrow; ComponentLink1Description: https://datasheet.ciiva.com/3934/87920530470410-pcb-headers-3934064.pdf?src-supplier=Arrow; Supplier 1: Mouser; Supplier Part Number 1: 538-53047-0410; Supplier 2: Farnell; Supplier Part Number 2: 9733060; Supplier 3: Digi-Key; Supplier Part Number 3: WM1733-ND; Supplier 4: Avnet; Supplier Part Number 4: 0530470410
R91 R92 = RC0603FR-073R9L: YAGEO - RC0603FR-073R9L - RES, 3R9, 1%, 0.1W, 0603, THICK FILM; Voltage Rating (DC): 50V; Power Rating: 100mW; Temperature Coefficient: 200ppm/°C; Supplier 1: Mouser; Supplier Part Number 1: 603-RC0603FR-073R9L; Manufacturer: Yageo; Manufacturer Part Number: RC0603FR-073R9L; Stock 1: 33978; Pricing 1: 1 = 0.15000, 10 = 0.03600, 50 = 0.03600, 100 = 0.01200, 1000 = 0.00900, 5000 = 0.00600, 10000 = 0.00600, 25000 = 0.00500, 50000 = 0.00400 (USD); RoHS: Yes; Case/Package: 0603; Number of Pins: 2; Case Code (Imperial): 0603; Case Code (Metric): 1608; Min Operating Temperature: -55°C; Max Operating Temperature: 155°C; Resistance: 3R9; Tolerance: 1%; Voltage Rating: 50V; Packaging: Tape and Reel; Composition: Thick Film; Number of Terminations: 2; Termination: SMD/SMT; Military Standard: Not; Max Power Dissipation: 100mW; Features: Moisture Resistant; Length: 1.6mm; Height: 0.45mm; Width: 0.8mm; Depth: 0.8mm; REACH SVHC: Unknown; ComponentLink1URL: https://datasheet.ciiva.com/11819/0900766b80c66297-11819668.pdf?src-supplier=RSComponents; ComponentLink1Description: https://datasheet.ciiva.com/11819/0900766b80c66297-11819668.pdf?src-supplier=RSComponents; ComponentLink2URL: https://datasheet.ciiva.com/12575/rc0603-272842-12575846.pdf?src-supplier=Mouser; ComponentLink2Description: https://datasheet.ciiva.com/12575/rc0603-272842-12575846.pdf?src-supplier=Mouser; Supplier 2: Farnell; Supplier Part Number 2: 9238190; Supplier 3: Arrow; Supplier Part Number 3: RC0603FR-073R9L
U30 = LDK320M33R: IC REG LINEAR 200MA SOT23-5; Manufacturer: STMicroelectronics; Output Configuration: Positive; Output Type: Fixed; Voltage - Input (Max): 18V; Voltage - Output (Min/Fixed): 3.3V; Voltage Dropout (Max): 0.35V @ 200mA; PSRR: 88dB (120Hz); Control Features: Enable; Protection Features: Over Current, Over Temperature; Manufacturer Part Number: LDK320M33R; RoHS: RoHS Compliant; Category: Integrated Circuits (ICs); Stock 1: 5592; Pricing 1: 1=0.85, 10=0.748, 100=0.5733, 500=0.4532, 1000=0.36256 (USD); Packaging: Cut Tape (CT); Part Status: Active; Current - Output: 200mA; Operating Temperature: -40°C ~ 125°C (TJ); Mounting Type: Surface Mount; Package / Case: SC-74A, SOT-753; Supplier Device Package: SOT-23-5; ComponentLink1URL: http://www.st.com/content/ccc/resource/technical/document/datasheet/0e/0c/26/c9/a4/d4/4b/a1/DM00236470.pdf/files/DM00236470.pdf/jcr:content/translations/en.DM00236470.pdf; ComponentLink1Description: http://www.st.com/content/ccc/resource/technical/document/datasheet/0e/0c/26/c9/a4/d4/4b/a1/DM00236470.pdf/files/DM00236470.pdf/jcr:content/translations/en.DM00236470.pdf; Supplier 1: Mouser; Supplier Part Number 1: 511-LDK320M33R; Supplier 2: Farnell; Supplier Part Number 2: 3130011; Supplier 3: Digi-Key; Supplier Part Number 3: 497-17034-1-ND